# Altium project WULPUS_HV_PCB_V2.PrjPcb
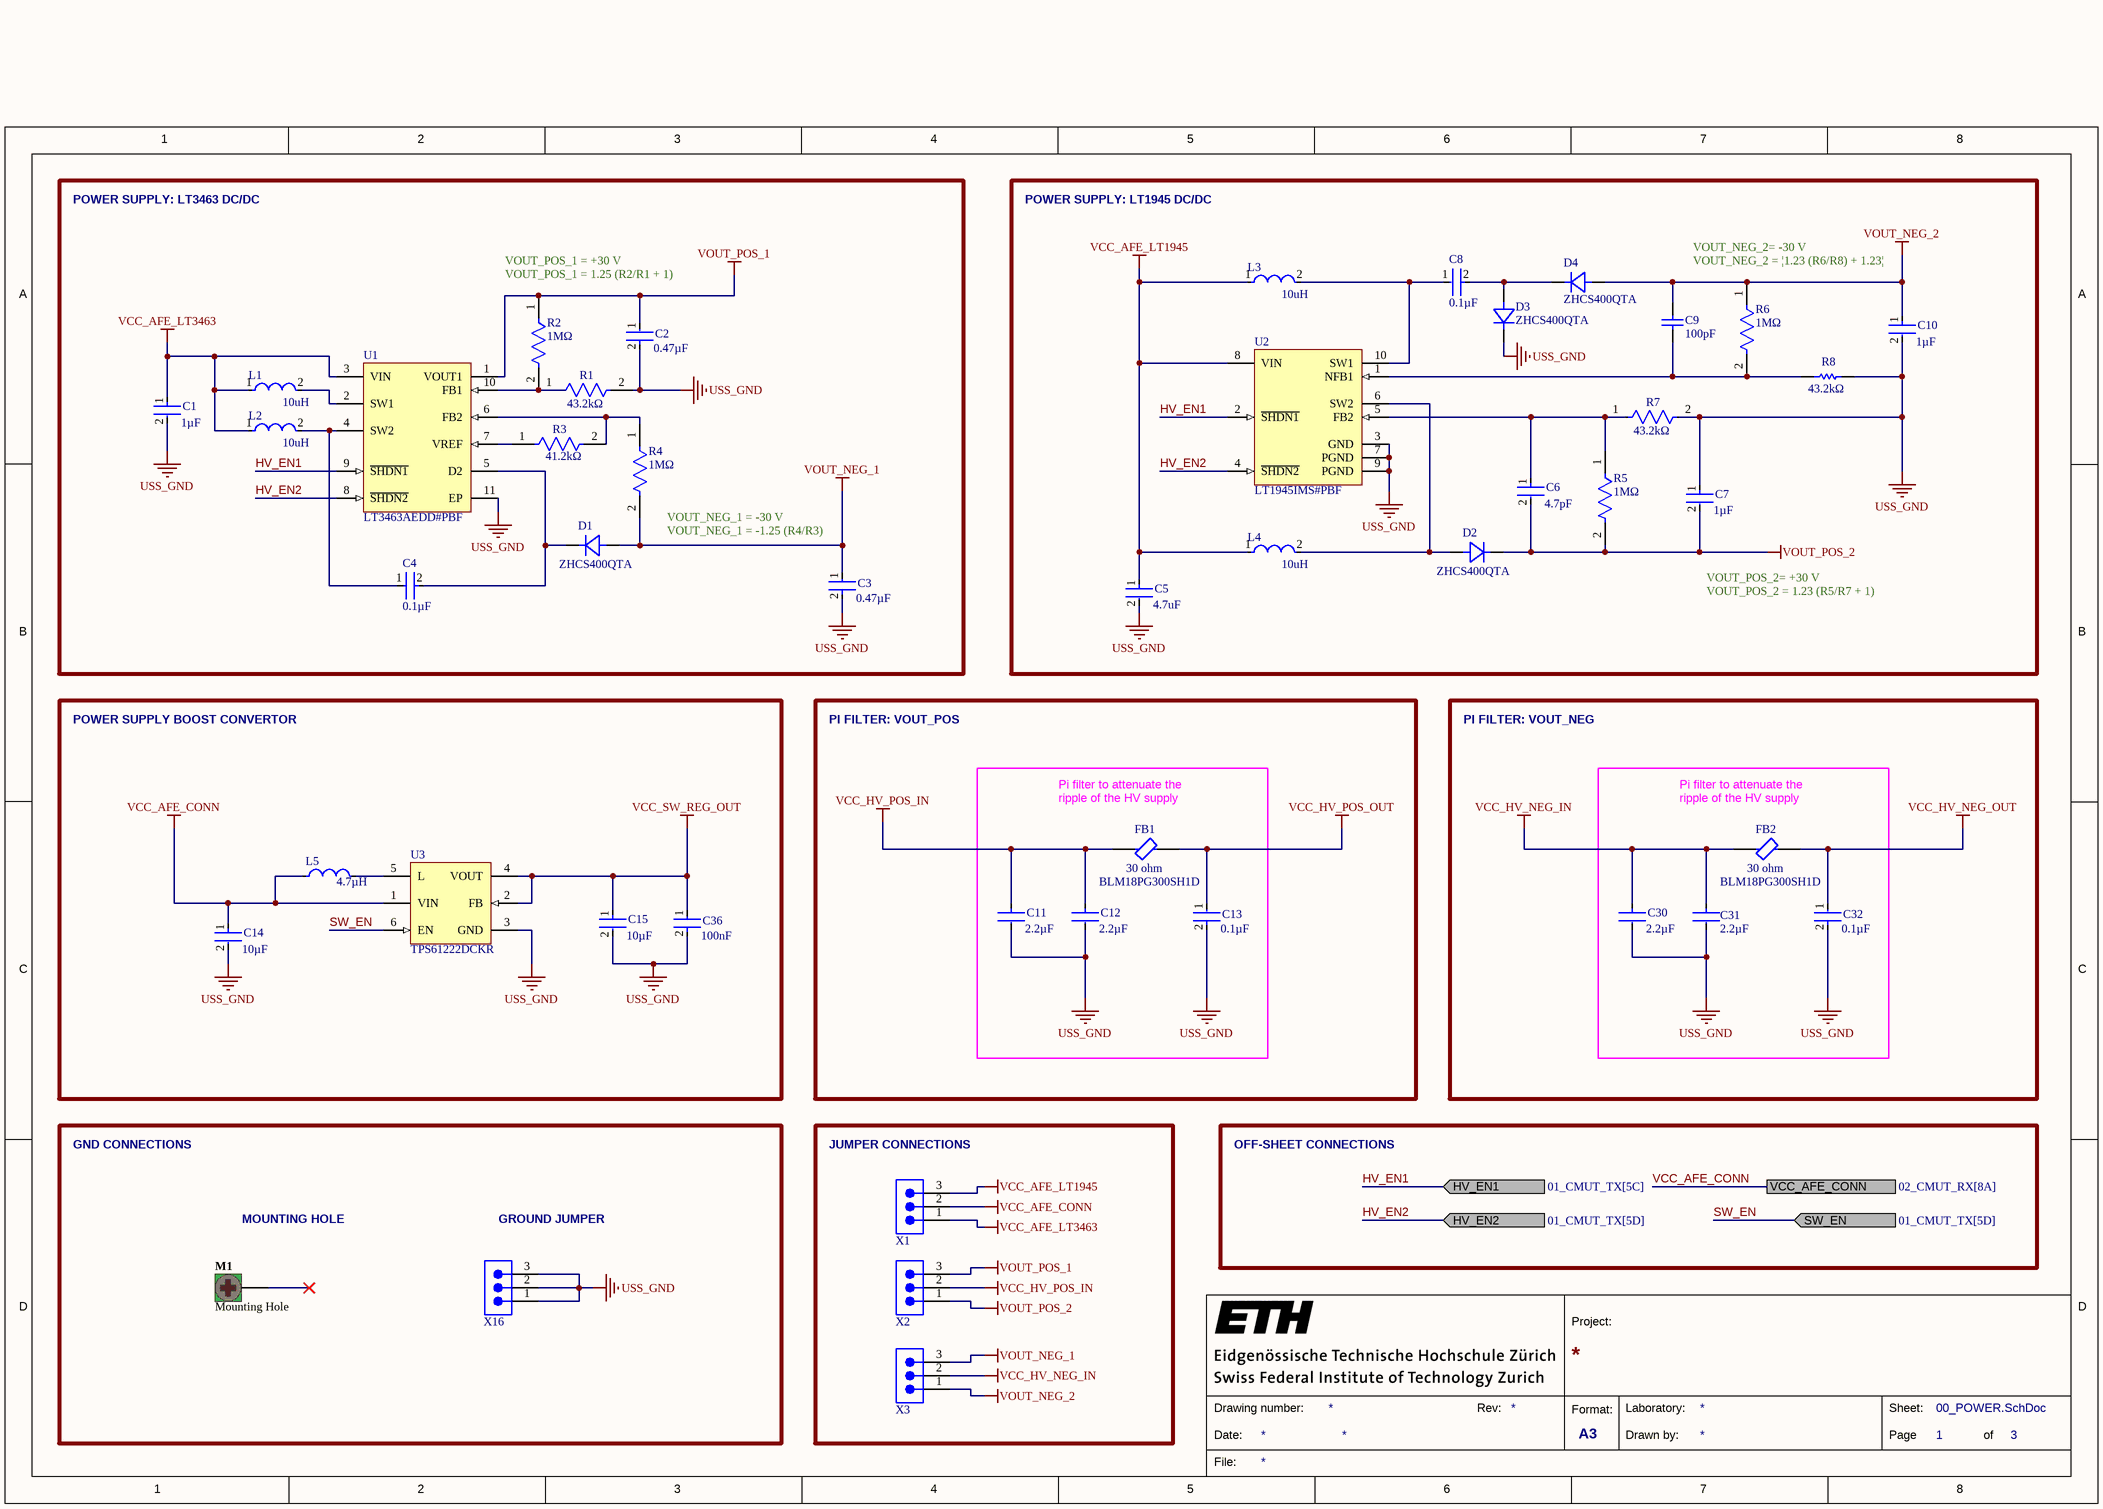
[diagram p0: 00_POWER.SchDoc]
3 sheets, 125 parts. Net scope: flat (ports and power ports of the same name join across sheets).
Board file: PCB1.PcbDoc
Sheets:
  00_POWER.SchDoc
  01_CMUT_TX.SchDoc
  02_CMUT_RX.SchDoc

## Sheet 00_POWER.SchDoc
size A3; SheetNumber: 1; SheetTotal: 3; SPICEModelCacheBHQUMUQP: <root> / <DocumentId>BHQUMUQP</DocumentId> / </root>

### Parts
C1  Capacitance: 1µF  [FP-CGA3E-0_3-0_1-IPC_B]  (hidden comment: CGA3E3X5R1H105K)
C2  Capacitance: 0.47µF  [FP-C1608-080-0_1-IPC_C]  (hidden comment: C1608X5R1H474K080AB)
C3  Capacitance: 0.47µF  [FP-C1608-080-0_1-IPC_C]  (hidden comment: C1608X5R1H474K080AB)
C4  Capacitance: 0.1µF  [FP-C1608-080-0_1-MFG]  (hidden comment: C1608X5R1H104K080AA)
C5  Capacitance: 4.7uF  [FP-C1608-080-0_2-MFG]  (hidden comment: C1608X5R1V475K080AC)
C6  Capacitance: 4.7pF  [FP-C0603C-CF-MFG]  (hidden comment: C0603C479K5GAC7867)
C7  Capacitance: 1µF  [FP-CGA3E-0_3-0_1-IPC_B]  (hidden comment: CGA3E3X5R1H105K)
C8  Capacitance: 0.1µF  [FP-C1608-080-0_1-MFG]  (hidden comment: C1608X5R1H104K080AA)
C9  Capacitance: 100pF  [CAPC1608X90X35LL15T15]  (hidden comment: 06035C101KAT2A)
C10  Capacitance: 1µF  [FP-CGA3E-0_3-0_1-IPC_B]  (hidden comment: CGA3E3X5R1H105K)
C11  Capacitance: 2.2µF  [FP-GRM188-0_2-IPC_C]  (hidden comment: GRM188R61H225KE11D)
C12  Capacitance: 2.2µF  [FP-GRM188-0_2-IPC_C]  (hidden comment: GRM188R61H225KE11D)
C13  Capacitance: 0.1µF  [FP-C1608-080-0_1-MFG]  (hidden comment: C1608X5R1H104K080AA)
C14  Capacitance: 10µF  [FP-GRM188-0_2-IPC_C]  (hidden comment: GRM188R6YA106MA73D)
C15  Capacitance: 10µF  [FP-GRM188-0_2-IPC_C]  (hidden comment: GRM188R6YA106MA73D)
C30  Capacitance: 2.2µF  [FP-GRM188-0_2-IPC_C]  (hidden comment: GRM188R61H225KE11D)
C31  Capacitance: 2.2µF  [FP-GRM188-0_2-IPC_C]  (hidden comment: Murata GRM188R61H225KE11D)
C32  Capacitance: 0.1µF  [FP-C1608-080-0_1-MFG]  (hidden comment: C1608X5R1H104K080AA)
C36  Capacitance: 100nF  [FP-C1608-080-0_1-MFG]  (hidden comment: C1608X5R1H104K080AA)
D1  ZHCS400QTA  [DIODE_SOD323_DIO]
D2  ZHCS400QTA  [DIODE_SOD323_DIO]
D3  ZHCS400QTA  [DIODE_SOD323_DIO]
D4  ZHCS400QTA  [DIODE_SOD323_DIO]
FB1  BLM18PG300SH1D  Impedance: 30 ohm  [FP-BLM18-0_15-t0_8-IPC_A]
FB2  BLM18PG300SH1D  Impedance: 30 ohm  [FP-BLM18-0_15-t0_8-IPC_A]
L1  Inductance: 10uH  [FP-B82422A-MFG]  (hidden comment: B82422A1103K100)
L2  Inductance: 10uH  [FP-B82422A-MFG]  (hidden comment: B82422A1103K100)
L3  Inductance: 10uH  [FP-B82422A-MFG]  (hidden comment: B82422A1103K100)
L4  Inductance: 10uH  [FP-B82422A-MFG]  (hidden comment: B82422A1103K100)
L5  Inductance: 4.7µH  [FP-NR3012-MFG]  (hidden comment: NR3012T4R7M)
M1  Mounting Hole  [Mounting Hole]  (no BOM)
R1  Resistance: 43.2kΩ  [FP-RC0603-0_55-MFG]  (hidden comment: RC0603FR-0743K2L)
R2  Resistance: 1MΩ  [FP-RC0603-0_55-IPC_C]  (hidden comment: RC0603JR-071ML)
R3  Resistance: 41.2kΩ  [FP-RK73H1J-IPC_A]  (hidden comment: RK73H1JTTDD4122D)
R4  Resistance: 1MΩ  [FP-RC0603-0_55-IPC_C]  (hidden comment: RC0603JR-071ML)
R5  Resistance: 1MΩ  [FP-RC0603-0_55-IPC_C]  (hidden comment: RC0603JR-071ML)
R6  Resistance: 1MΩ  [FP-RC0603-0_55-IPC_C]  (hidden comment: RC0603JR-071ML)
R7  Resistance: 43.2kΩ  [FP-RC0603-0_55-MFG]  (hidden comment: RC0603FR-0743K2L)
R8  Resistance: 43.2kΩ  [RESC1608X55X30ML20T10]  (hidden comment: RK73H1JTTD4322F)
U1  LT3463AEDD#PBF  [LT-DD-10_V]
U2  LT1945IMS#PBF  [LT-MS-10_L]
U3  TPS61222DCKR  [DCK0006A_L]
X1  68000-103HLF  [68000-103HLF]  (value not drawn)
X2  68000-103HLF  [68000-103HLF]  (value not drawn)
X3  68000-103HLF  [68000-103HLF]  (value not drawn)
X16  68000-103HLF  [68000-103HLF]  (value not drawn)

### Blocks framed on the sheet
POWER SUPPLY BOOST CONVERTOR: C14 C15 C36 L5 U3
PI FILTER: VOUT_POS: C11-C13 FB1
PI FILTER: VOUT_NEG: C30-C32 FB2
JUMPER CONNECTIONS: X1-X3

### Ports
HV_EN1 (in, see 01_CMUT_TX[5C]), HV_EN2 (in, see 01_CMUT_TX[5D]), SW_EN (in, see 01_CMUT_TX[5D]), VCC_AFE_CONN (see 02_CMUT_RX[8A])

### Nets
USS_GND: C1.2 C2.2 C3.2 C5.2 C7.1 C10.2 C11.2 C12.2 C13.2 C14.2 C15.2 C30.2 C31.2 C32.2 C36.2 D3.1 R1.2 R7.2 R8.2 U1.11(EP) U2.3(GND) U2.7(PGND) U2.9(PGND) U3.3(GND) X16.1 X16.2 X16.3
VCC_AFE_CONN: C14.1 L5.1 U3.1(VIN) X1.2 ; port VCC_AFE_CONN
VCC_AFE_LT1945: C5.1 L3.1 L4.1 U2.8(VIN) X1.3
VCC_AFE_LT3463: C1.1 L1.1 L2.1 U1.3(VIN) X1.1
VCC_HV_NEG_IN: C30.1 C31.1 FB2.1 X3.2
VCC_HV_NEG_OUT: C32.1 FB2.2
VCC_HV_POS_IN: C11.1 C12.1 FB1.1 X2.2
VCC_HV_POS_OUT: C13.1 FB1.2
VCC_SW_REG_OUT: C15.1 C36.1 U3.2(FB) U3.4(VOUT)
VOUT_NEG_1: C3.1 D1.2 R4.2 X3.3
VOUT_NEG_2: C9.2 C10.1 D4.2 R6.1 X3.1
VOUT_POS_1: C2.1 R2.1 U1.1(VOUT1) X2.3
VOUT_POS_2: C6.2 C7.2 D2.1 R5.2 X2.1
HV_EN1: U1.9(~{SHDN1}) U2.2(~{SHDN1}) ; port HV_EN1
HV_EN2: U1.8(~{SHDN2}) U2.4(~{SHDN2}) ; port HV_EN2
SW_EN: U3.6(EN) ; port SW_EN
NetC4_1: C4.1 L2.2 U1.4(SW2)
NetC4_2: C4.2 D1.1 U1.5(D2)
NetC6_1: C6.1 R5.1 R7.1 U2.5(FB2)
NetC8_1: C8.1 L3.2 U2.10(SW1)
NetC8_2: C8.2 D3.2 D4.1
NetC9_1: C9.1 R6.2 R8.1 U2.1(NFB1)
NetD2_2: D2.2 L4.2 U2.6(SW2)
NetL1_2: L1.2 U1.2(SW1)
NetL5_2: L5.2 U3.5(L)
NetR1_1: R1.1 R2.2 U1.10(FB1)
NetR3_1: R3.1 U1.7(VREF)
NetR3_2: R3.2 R4.1 U1.6(FB2)

Not connected (* = marked no-connect by the designer): M1 1*

### Notes on the sheet
- POWER SUPPLY: LT3463 DC/DC
- POWER SUPPLY: LT1945 DC/DC
- VOUT_POS_1 = 1.25 (R2/R1 + 1)
- VOUT_POS_1 = +30 V
- VOUT_NEG_2 = |1.23 (R6/R8) + 1.23|
- VOUT_NEG_2= -30 V
- VOUT_NEG_1 = -1.25 (R4/R3)
- (near R4) VOUT_NEG_1 = -30 V
- VOUT_POS_2= +30 V
- VOUT_POS_2 = 1.23 (R5/R7 + 1)
- (near FB1) Pi filter to attenuate the ripple of the HV supply
- (near FB2) Pi filter to attenuate the ripple of the HV supply
- GND CONNECTIONS
- OFF-SHEET CONNECTIONS
- MOUNTING HOLE
- (near X16) GROUND JUMPER
- 1
- 2
- 3
- 4
- 5
- 6
- 7
- 8
- A
- B
- C
- D
- Project:
- Date:
- Drawing number:
- Rev:
- Format:
- A3
- Drawn by:
- Laboratory:
- Page
- Sheet:
- of
- File:

### Library data of the parts
C1 C7 C10 = CMP-08246-000317-1: Cap Ceramic 1uF 50V X5R 10% Pad SMD 0603 +85°C Automotive T/R; Termination: SMD/SMT; Tolerance: 10%; Case Code (Metric): 1608; Max Operating Temperature: 85°C; Case/Package: 0603; Voltage Rating: 50V; Dielectric: X5R; Case Code (Imperial): 0603; Packaging: Tape and Reel; Min Operating Temperature: -55°C; Voltage Rating (DC): 50V
C2 C3 = CMP-08246-003456-1: Multilayer Ceramic Capacitors 470nF ±10% 50V X5R SMD 0603; Termination: SMD/SMT; Weight: 7.1E-05oz; Depth: 0.8mm; Mount: Surface Mount; Voltage Rating (DC): 50V; RoHS Compliant: Yes; Dielectric: X5R; Voltage: 50V; Package Quantity: 1; Series: C; Max Operating Temperature: 85°C; Construction: Flat; Tolerance: 10%; Voltage Rating: 50V; Packaging: Tape and Reel; Number of Pins: 2; Case Code (Imperial): 0603; Resistor Type: Ceramic; Min Operating Temperature: -55°C; Height: 0.8mm; Case/Package: 0603; Dielectric Material: Ceramic; Radiation Hardening: No; Case Code (Metric): 1608; REACH SVHC: No SVHC; Thickness: 0.035inch; Width: 0.031inch; Length: 1.6mm; Lead Free: Lead Free
C4 C8 C13 C32 C36 = CMP-08246-002719-1: Multilayer Ceramic Capacitors 100nF ±10% 50V X5R SMD 0603; Radiation Hardening: No; Length: 1.6mm; Package Quantity: 1; Thickness: 0.035inch; Max Operating Temperature: 85°C; Series: C; RoHS Compliant: Yes; Weight: 7.1E-05oz; Resistor Type: Ceramic; Case/Package: 0603; Voltage Rating: 50V; Tolerance: 10%; Width: 0.031inch; Voltage Rating (DC): 50V; Termination: SMD/SMT; Case Code (Metric): 1608; Construction: Flat; Mount: Surface Mount; Dielectric Material: Ceramic; Number of Pins: 2; Lead Free: Lead Free; Packaging: Tape and Reel; Min Operating Temperature: -55°C; Dielectric: X5R; Case Code (Imperial): 0603; Depth: 0.8mm; Height: 0.8mm; REACH SVHC: No SVHC
C5 = CMP-08246-004349-1: CAP CER 4.7UF 35V X5R 0603; Tolerance: 10%; Dielectric Material: Ceramic; Length: 0.063inch; Case/Package: 0603; Case Code (Metric): 1608; Packaging: Tape and Reel; Width: 0.031inch; Voltage Rating: 35V; Mount: Surface Mount; Package Quantity: 1; Depth: 0.8mm; Case Code (Imperial): 0603; Lead Free: Lead Free; Voltage Rating (DC): 35V; RoHS Compliant: Yes; Resistor Type: Ceramic; Series: C; Dielectric: X5R; Thickness: 0.039inch; Min Operating Temperature: -55°C; REACH SVHC: No SVHC; Max Operating Temperature: 85°C; Termination: SMD/SMT; Weight: 7.1E-05oz; Height: 0.8mm
C6 = CMP-03020-034431-1: CAP CER 4.7PF 50V NP0 0603; Manufacturer: KEMET; Automotive Grade: Grade 1; Material: Ceramic; Temperature Coefficient: 30ppm/°C; Temperature Characteristic: C0G; Tolerance: 0.1; Device Class L2: Capacitors; Temperature Range High: +125°C; Octopart: https://octopart.com/c0603c479k5gac7867-kemet-2009260; Temperature: -55°C to +125°C; Manufacturer Part Number: C0603C479K5GAC7867; Device Class L1: Passive Components; Temperature Range Low: -55°C; ComponentLink2Description: Datasheet; Automotive: Yes; Voltage Rating: 50 V; Height: 0.87mm; RoHS: TRUE; Digikey Description: CAP CER 4.7PF 50V NP0 0603; ComponentLink2URL: https://api.kemet.com/component-edge/download/datasheet/C0603C100J5GACAUTO.pdf; Lead Free: Yes; Package: C0603C-CF; Device Class L3: Ceramic Capacitors; Category: Cap; Value: 4.7 pF
C9 = CMP-2006-04375-1: Manufacturer: AVX Interconnect / Elco; Part Number: 06035C101KAT2A
C11 C12 C30 C31 = CMP-06035-042125-1: Chip Multilayer Ceramic Capacitors for General Purpose, 0603, 2.2uF, X5R, 15%, 10%, 50V; Case Code (Metric): 1608; Packaging: Cut Tape; REACH SVHC: No SVHC; Material: Ceramic; Voltage Rating: 50V; Min Operating Temperature: -55°C; Length: 0.063inch; Case Code (Imperial): 0603; Tolerance: 10%; Thickness: 0.039inch; Height: 0.8mm; Case/Package: 0603; Voltage Rating (DC): 50V; Dielectric: X5R; Mount: Surface Mount; Max Operating Temperature: 85°C; Width: 0.031inch
C14 C15 = CMP-06035-045466-1: Chip Multilayer Ceramic Capacitors for General Purpose, 0603, 10uF, X5R, 15%, 20%, 35V; Case Code (Imperial): 0603; Voltage Rating (DC): 35V; Width: 0.031inch; Dielectric: X5R; Voltage Rating: 35V; Min Operating Temperature: -55°C; Thickness: 0.039inch; Mount: Surface Mount; Case/Package: 0603; Length: 0.063inch; Max Operating Temperature: 85°C; Packaging: Tape and Reel; Tolerance: 20%; Case Code (Metric): 1608
D1-D4 = ZHCS400QTA: Diode Schottky 40V 1A Automotive 2-Pin SOD-323 T/R; Manufacturer: Diodes; Supplier 1: Farnell; RoHS: Yes; Category: Rectifier Diodes; Stock 1: 385; Pricing 1: 5=0.87300, 10=0.73400, 100=0.49400, 500=0.38800 (CHF); Mount: Surface Mount; Packaging: Tape and Reel; Average Rectified Current: 1A; Max Reverse Voltage (DC): 40V; RoHS Compliant: Yes; ComponentLink1URL: http://www.mouser.com/ds/2/115/ZHCS400Q-959646.pdf?src-supplier=Mouser; ComponentLink1Description: http://www.mouser.com/ds/2/115/ZHCS400Q-959646.pdf?src-supplier=Mouser; Supplier Part Number 1: 3127490; Manufacturer Part Number: ZHCS400QTA
FB1 FB2 = CMP-06046-000808-1: Chip Ferrite Bead, 0603, 30Ω @ 100MHz, 0.05Ω, , 1A; Tolerance: 25%; Shielding: Unshielded; DC Resistance (DCR): 50mR; Number of Lines: 1; Width: 0.031inch; Termination: SMD/SMT; Case Code (Metric): 1608; Max DC Current: 1A; Case Code (Imperial): 0603; Height: 0.037inch; Max Operating Temperature: 125°C; Max Current Rating: 1A; Case/Package: 0603; Length: 1.6mm; Number of Circuits: 1; Test Frequency: 100MHz; Contact Plating: Tin; Ratings: AEC-Q200; Package Quantity: 1; Mount: Surface Mount; Packaging: Tape and Reel; Min Operating Temperature: -55°C
L1-L4 = CMP-2000-05912-2: FIXED IND 10UH 180MA 1.6 OHM SMD; Tolerance: 10%; DC Resistance (DCR): 1.6R; Shielding: Unshielded; Core Material: Ferrite; Q Factor: 27; Self Resonant Frequency: 25MHz; Test Frequency: 1MHz; Series: SIMID; Current Rating: 180mA; Ratings: AEC-Q200; Height - Seated (Max): 0.083inch; Packaging: Tape and Reel; Radiation Hardening: No; REACH SVHC: No SVHC; Width: 0.098inch; RoHS Compliant: Yes; Case/Package: 1210; DC Current: 180mA; Package Quantity: 2000; Rated Current-Max: 180mA; Mount: Surface Mount; Depth: 2.8mm; Resistor Type: Wirewound; Max DC Current: 180mA; Termination: SMD/SMT; Contact Plating: Tin; Height: 2.1mm; Case Code (Metric): 3225; Lead Free: Lead Free; Weight: 0.001764oz; Max Operating Temperature: 125°C; Length: 3.5mm; Case Code (Imperial): 1210; Inductance Tolerance: 10%; Series Resistance: 1.6R; Number of Pins: 2; Military Standard: Not
L5 = CMP-14484-001484-1: SMD Power Inductors 4.7uH ±20% 0.77A 0.13Ω; Saturation Current: 770mA; Self Resonant Frequency: 48MHz; RMS Current (Irms): 980mA; Test Frequency: 100kHz; Core Material: Ferrite; Shielding: Shielded; DC Resistance (DCR): 156mR; Series: NR; Case Code (Metric): 3030; Halogen Free: Halogen Free; Tolerance: 20%; Resistor Type: Wirewound; Mount: Surface Mount; Case/Package: 1212; Max DC Current: 770mA; Length: 0.118inch; Height - Seated (Max): 0.047inch; Termination: SMD/SMT; Package Quantity: 2000; DC Current: 980mA; Depth: 3.1mm; Packaging: Tape and Reel; Height: 1.2mm; Current Rating: 980mA; Min Operating Temperature: -25°C; Case Code (Imperial): 1212; Lead Free: Lead Free; Military Standard: Not; Width: 0.118inch; Max Operating Temperature: 120°C; Radiation Hardening: No; Inductance Tolerance: 20%; RoHS Compliant: Yes
M1 = CMP-00274-1: M2 Hole, 2.4mm drill, 5mm landing pads, 3mm pad in middle layers, no overlay; ClassName: Mounting Hole
R1 R7 = CMP-03412-037801-1: RES SMD 43.2K OHM 1% 1/10W 0603; Power Rating: 100mW; Voltage Rating (DC): 50V; Temperature Coefficient: 100ppm/°C; Depth: 0.8mm; Resistor Type: Thick Film; Mount: Surface Mount; Height: 0.45mm; Termination: SMD/SMT; Case Code (Imperial): 0603; Case Code (Metric): 1608; Case/Package: 0603; Length: 1.6mm; Min Operating Temperature: -55°C; Max Power Dissipation: 100mW; Construction: Rectangular; Lead Free: Lead Free; Features: Moisture Resistant; Technology: THICK FILM; RoHS Compliant: Yes; Packaging: Tape and Reel; Package Quantity: 1; Width: 0.031inch; Tolerance: 1%; Number of Terminations: 2; Series: RC; Voltage Rating: 50V; Max Operating Temperature: 155°C; Size Code: 0603; Military Standard: Not
R2 R4-R6 = CMP-2000-06953-2: RES SMD 1M OHM 5% 1/10W 0603; Voltage Rating (DC): 50V; Power Rating: 100mW; Temperature Coefficient: 100ppm/°C; Features: Moisture Resistant; Package Quantity: 5000; Case Code (Imperial): 0603; Packaging: Tape and Reel; Resistor Type: Thick Film; Number of Pins: 2; Size Code: 0603; Resistance Tolerance: 5%; Max Operating Temperature: 155°C; Voltage Rating: 50V; Depth: 0.8mm; Termination: SMD/SMT; Width: 0.8mm; RoHS Compliant: Yes; Number of Terminations: 2; Height: 0.45mm; Lead Free: Lead Free; Case/Package: 0603; Military Standard: Not; Min Operating Temperature: -55°C; Case Code (Metric): 1608; Radiation Hardening: No; Series: RC; Length: 1.6mm; Tolerance: 5%; REACH SVHC: No SVHC; Contact Plating: Tin; Construction: Rectangular; Max Power Dissipation: 100mW
R3 = CMP-04015-070888-1: 41.2kΩ ±0.5% 0.1W Chip Resistor 0603 Thick Film AEC-Q200 Qualified; Power Rating: 100mW; Voltage Rating: 50V; Temperature Coefficient: 100ppm/°C; Packaging: Tape and Reel; RoHS Compliant: Yes; Case Code (Imperial): 0603; Termination: SMD/SMT; Case Code (Metric): 1608; Max Operating Temperature: 155°C; Length: 1.6mm; Height: 0.45mm; Min Operating Temperature: -55°C; Case/Package: 0603; Width: 0.8mm; Resistor Type: Thick Film; Series: RK73H; Tolerance: 0.5%; Weight: 7.1E-05oz
R8 = CMP-2000-01507-1: Manufacturer: KOA Speer; Part Number: RK73H1JTTD4322F
U1 = CMP-0478-00030-1: Dual Micropower DC/DC Converters with Schottky Diodes, 2.4 to 15 V Vin, 10-pin SON (DD-10), -40 to 85 degC, Pb-Free; Manufacturer: Linear Technology; Vin Max(V): 15; Number of Outputs: 2; Vin Min(V): 2.4; ComponentLink3URL: http://cds.linear.com/docs/en/packaging/DFN_10_05-08-1699.pdf; ComponentLink2URL: http://cds.linear.com/docs/en/datasheet/3463f.pdf; PackageReference: DD-10; PackageVersion: Rev. C, 06/2010; ComponentLink1URL: http://www.linear.com/; RoHS: TRUE; ComponentLink3Description: Package Specification; Mounting Technology: Surface Mount; PartNumber: LT3463AEDD#PBF; Code_JEDEC: MO-229; ComponentLink2Description: Datasheet; PackageDescription: 10-Pin Plastic DFN, Body 3 x 3 mm, Pitch 0.5 mm; ComponentLink1Description: Manufacturer URL
U2 = CMP-0478-00154-1: Dual Micropower DC/DC Converter with Positive and Negative Outputs, 1.2 to 15 V Vin, 10-pin SOP (MS-10), -40 to 125 degC, Pb-Free; Manufacturer: Linear Technology; Vin Min(V): 1.2; Vin Max(V): 15; Number of Outputs: 2; Mounting Technology: Surface Mount; ComponentLink3Description: Package Specification; ComponentLink3URL: http://cds.linear.com/docs/en/packaging/05081661_F_MS.pdf; PackageVersion: Rev. E, 06/2010; ComponentLink2URL: http://cds.linear.com/docs/en/datasheet/1945fa.pdf; PartNumber: LT1945IMS#PBF; DatasheetVersion: Rev. A; PackageReference: MS-10; PackageDescription: 10-Pin Plastic MSOP, Body 3 x 3 mm, Pitch 0.5 mm; ComponentLink2Description: Datasheet; RoHS: TRUE; ComponentLink1URL: http://www.linear.com/; ComponentLink1Description: Manufacturer URL
U3 = CMP-0347-00055-2: Boost Voltage Converter with 0.7 to 5.5 V Input and 5 V Output, -40 to 85 degC, 6-Pin SC70 (DCK), Green (RoHS & no Sb/Br); Manufacturer: Texas Instruments; Vout(Min)(V): 5; SubFamily: Step-Up Regulator; Vin(Min)(V): 0.7; Switching Frequency(Max)(kHz): 2000; Regulated Outputs(#): 1; Vin(Max)(V): 5.5; Topology: Boost; Vout(Max)(V): 5; PackageVersion: revG, Jan-2007; Mounting Technology: Surface Mount; ComponentLink2URL: http://www.ti.com/litv/pdf/mpds114c; PackageReference: DCK0006A; DatasheetVersion: SLVS776; PartNumber: TPS61222DCKR; ComponentLink1Description: Datasheet; ComponentLink1URL: http://www.ti.com/general/docs/lit/getliterature.tsp?genericPartNumber=TPS61222&fileType=pdf; ComponentLink2Description: Package Specification; Eco-Plan: Green (RoHS & no Sb/Br); Code_JEDEC: MO-203-AB; PackageDescription: 6-Pin Plastic Small-Outline Package, 2 x 1.3 mm Body, 0.65 mm Pitch, 2.1 mm Lead Span
X1-X3 X16 = CMP-00101-2: 3 Positions Header, Unshrouded Connector 0.100" (2.54mm) Through Hole Gold or Gold, GXT™; Manufacturer: Amphenol FCI; Current Rating: 3A; Insulation Resistance: 5GR; Number of Positions: 3; Max Voltage Rating (AC): 1.5kV; Termination: Solder; Fastening Type: -; Features: -; Contact Finish: Gold or Gold, GXT™; Contact Finish Thickness: 15µin (0.38µm); Color: Black; Supplier: Digikey; Supplier Part Number: 609-3461-ND; ComponentLink1Description: 68000-274283-5157301.pdf; ComponentLink1URL: https://datasheet.ciiva.com/5157/68000-274283-5157301.pdf; Depth: 2.41mm; Flammability Rating: UL94 V-0; Housing Colour: Black; Housing Material: Thermoplastic; Length: 7.62mm; Manufacturer Part Number: 68000-103HLF; Max Operating Temperature: 125°C; Packaging: Bulk; Contact Type: Male Pin; Connector Type: Header, Unshrouded; Pitch: 2.54mm; Number of Rows: 1; Contact Mating Length: 0.230" (5.84mm); Mounting Type: Through Hole; Min Operating Temperature: -65°C; Number of Contacts: 3; Orientation: Straight; Package Quantity: 100; Radiation Hardening: No; REACH SVHC: No SVHC; Termination Post Length: 2.41mm; Voltage Rating: 1.5kV; Contact Gender: Male; Contact Material: Bronze; Contact Plating: Nickel,Gold,GXT; ComponentLink2Description: 68000-731071.pdf; ComponentLink2URL: https://datasheet.ciiva.com/731/68000-731071.pdf; ComponentLink3Description: 68000-10149754.pdf; ComponentLink3URL: https://datasheet.ciiva.com/10149/68000-10149754.pdf; ComponentLink4Description: 1914865-46392021.pdf; ComponentLink4URL: https://datasheet.ciiva.com/46392/1914865-46392021.pdf

## Sheet 01_CMUT_TX.SchDoc
size A3; SheetNumber: 2; SheetTotal: 3
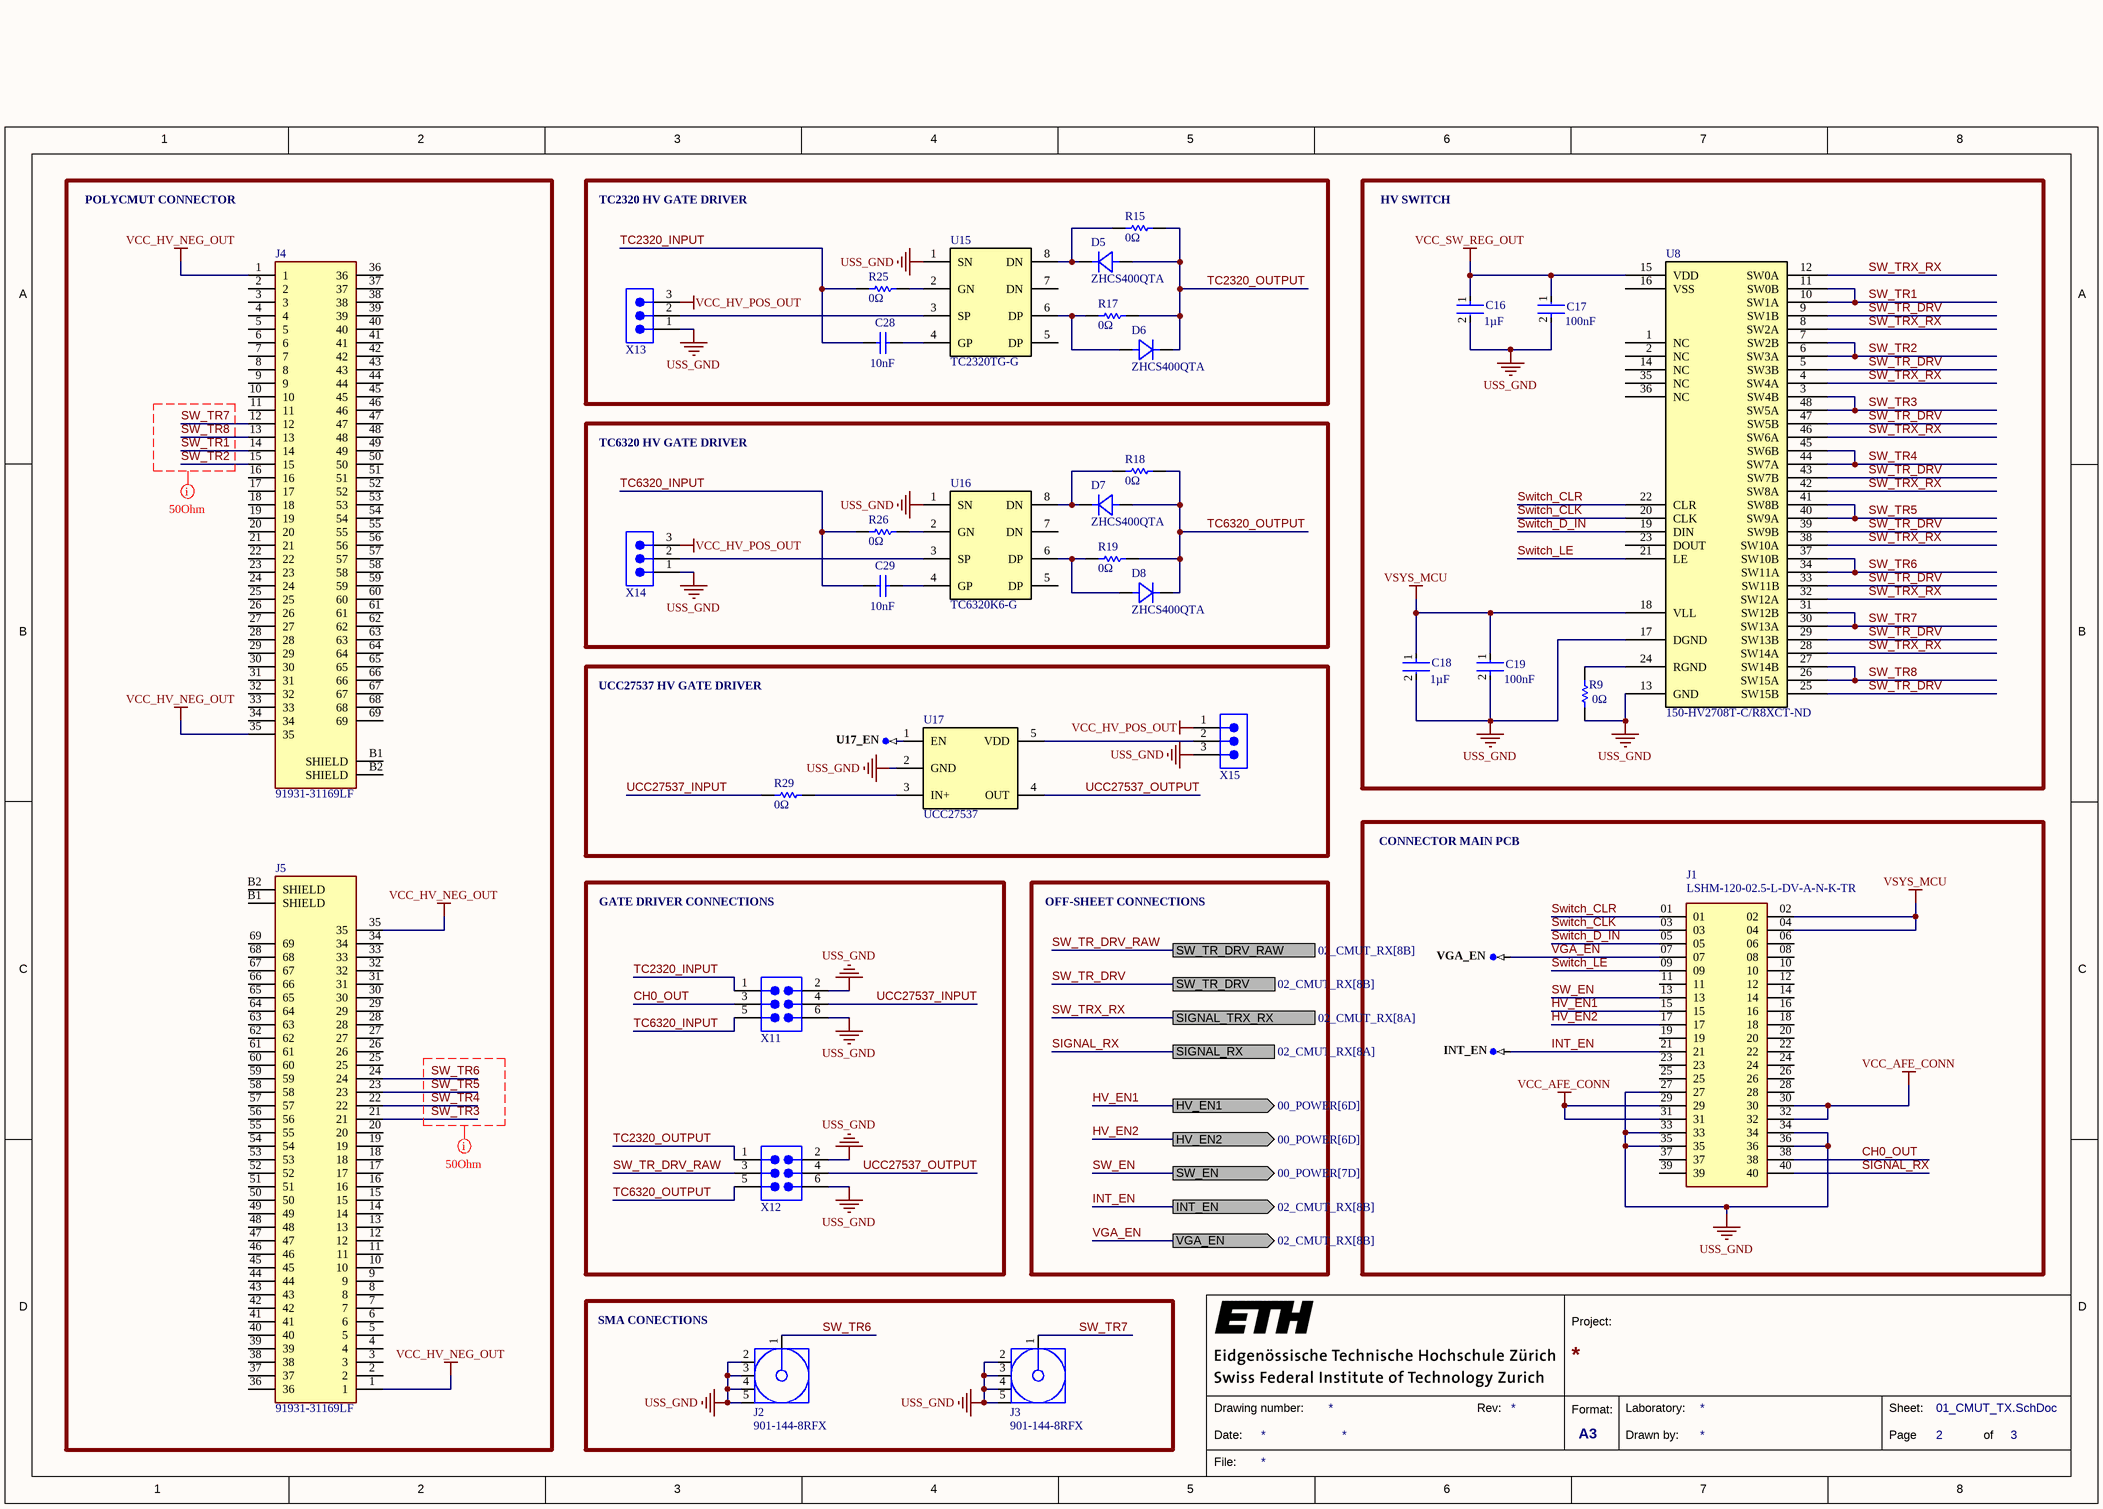
[diagram p1: 01_CMUT_TX.SchDoc]

### Parts
C16  Capacitance: 1µF  [FP-CGA3E-0_3-0_1-IPC_B]  (hidden comment: CGA3E3X5R1H105K)
C17  Capacitance: 100nF  [FP-C1608-080-0_1-MFG]  (hidden comment: C1608X5R1H104K080AA)
C18  Capacitance: 1µF  [FP-CGA3E-0_3-0_1-IPC_B]  (hidden comment: CGA3E3X5R1H105K)
C19  Capacitance: 100nF  [FP-C1608-080-0_1-MFG]  (hidden comment: C1608X5R1H104K080AA)
C28  Capacitance: 10nF  [CAPC1608X90X35NL15T15]  (hidden comment: 06035D103KAT2A)
C29  Capacitance: 10nF  [CAPC1608X90X35NL15T15]  (hidden comment: 06035D103KAT2A)
D5  ZHCS400QTA  [DIODE_SOD323_DIO]
D6  ZHCS400QTA  [DIODE_SOD323_DIO]
D7  ZHCS400QTA  [DIODE_SOD323_DIO]
D8  ZHCS400QTA  [DIODE_SOD323_DIO]
INT_EN  TP-SM-C-100  [TP-SM-C-100]  (value not drawn)  (no BOM)
J1  LSHM-120-02.5-L-DV-A-N-K-TR  [SAMTEC_LSHM-120-XX.X-X-DV-A-N-XX]
J2  901-144-8RFX  [AMPH-901-144-8RFX_V]
J3  901-144-8RFX  [AMPH-901-144-8RFX_V]
J4  91931-31169LF  [FRAMETOME_91931-31169LF]
J5  91931-31169LF  [FRAMETOME_91931-31169LF]
R9  Resistance: 0Ω  [RESC1608X55X25NL10T15]  (hidden comment: RC0603JR-130RL)
R15  Resistance: 0Ω  [RESC1608X55X25NL10T15]  (hidden comment: RC0603JR-130RL)
R17  Resistance: 0Ω  [RESC1608X55X25NL10T15]  (hidden comment: RC0603JR-130RL)
R18  Resistance: 0Ω  [RESC1608X55X25NL10T15]  (hidden comment: RC0603JR-130RL)
R19  Resistance: 0Ω  [RESC1608X55X25NL10T15]  (hidden comment: RC0603JR-130RL)
R25  Resistance: 0Ω  [RESC1608X55X25NL10T15]  (hidden comment: RC0603JR-130RL)
R26  Resistance: 0Ω  [RESC1608X55X25NL10T15]  (hidden comment: RC0603JR-130RL)
R29  Resistance: 0Ω  [RESC1608X55X25NL10T15]  (hidden comment: RC0603JR-130RL)
U8  Supplier Part Number 1: 150-HV2708T-C/R8XCT-ND  [LQFP48_7X7MC_MCH]  (hidden comment: HV2708T-C/R8X)
U15  TC2320TG-G  [SOIC127P599X173-8N]
U16  TC6320K6-G  [SOIC127P599X173-8N]
U17  UCC27537  [SOT95P280X145-5N]
U17_EN  TP-SM-C-100  [TP-SM-C-100]  (value not drawn)  (no BOM)
VGA_EN  TP-SM-C-100  [TP-SM-C-100]  (value not drawn)  (no BOM)
X11  67996-106HLF  [67996-106HLF]  (value not drawn)
X12  67996-106HLF  [67996-106HLF]  (value not drawn)
X13  68000-103HLF  [68000-103HLF]  (value not drawn)
X14  68000-103HLF  [68000-103HLF]  (value not drawn)
X15  68000-103HLF  [68000-103HLF]  (value not drawn)

### Blocks framed on the sheet
POLYCMUT CONNECTOR: J4 J5
TC2320 HV GATE DRIVER: C28 D5 D6 R15 R17 R25 U15 X13
HV SWITCH: C16-C19 R9 U8
TC6320 HV GATE DRIVER: C29 D7 D8 R18 R19 R26 U16 X14
UCC27537 HV GATE DRIVER: R29 U17 U17_EN X15
CONNECTOR MAIN PCB: INT_EN J1 VGA_EN
GATE DRIVER CONNECTIONS: X11 X12
SMA CONECTIONS: J2 J3

### Ports
HV_EN1 (out, see 00_POWER[6D]), HV_EN2 (out, see 00_POWER[6D]), INT_EN (out, see 02_CMUT_RX[8B]), SIGNAL_RX (see 02_CMUT_RX[8A]), SIGNAL_TRX_RX (see 02_CMUT_RX[8A]), SW_EN (out, see 00_POWER[7D]), SW_TR_DRV (see 02_CMUT_RX[8B]), SW_TR_DRV_RAW (see 02_CMUT_RX[8B]), VGA_EN (out, see 02_CMUT_RX[8B])

### Nets
SW_TR_DRV: U8.5(SW3B) U8.9(SW1B) U8.25(SW15B) U8.29(SW13B) U8.33(SW11B) U8.39(SW9B) U8.43(SW7B) U8.47(SW5B) ; port SW_TR_DRV
SW_TR_DRV_RAW: X12.3 ; port SW_TR_DRV_RAW
USS_GND: C16.2 C17.2 C18.2 C19.2 J1.27 J1.33 J1.34 J1.35 J1.36 J2.2 J2.3 J2.4 J2.5 J3.2 J3.3 J3.4 J3.5 R9.1 U8.13(GND) U8.17(DGND) U15.1(SN) U16.1(SN) U17.2(GND) X11.2 X11.6 X12.2 X12.6 X13.1 X14.1 X15.3
VCC_AFE_CONN: J1.29 J1.30 J1.31 J1.32
VCC_HV_NEG_OUT: J4.1 J4.35 J5.1 J5.35
VCC_HV_POS_OUT: X13.3 X14.3 X15.1
VCC_SW_REG_OUT: C16.1 C17.1 U8.15(VDD)
VSYS_MCU: C18.1 C19.1 J1.02 J1.04 U8.18(VLL)
CH0_OUT: J1.38 X11.3
HV_EN1: J1.15 ; port HV_EN1
HV_EN2: J1.17 ; port HV_EN2
INT_EN: INT_EN.1 J1.21 ; port INT_EN
SIGNAL_RX: J1.40 ; port SIGNAL_RX
SW_EN: J1.13 ; port SW_EN
SW_TR1: J4.14 U8.10(SW1A) U8.11(SW0B)
SW_TR2: J4.15 U8.6(SW3A) U8.7(SW2B)
SW_TR3: J5.21 U8.3(SW4B) U8.48(SW5A)
SW_TR4: J5.22 U8.44(SW7A) U8.45(SW6B)
SW_TR5: J5.23 U8.40(SW9A) U8.41(SW8B)
SW_TR6: J2.1 J5.24 U8.34(SW11A) U8.37(SW10B)
SW_TR7: J3.1 J4.12 U8.30(SW13A) U8.31(SW12B)
SW_TR8: J4.13 U8.26(SW15A) U8.27(SW14B)
SW_TRX_RX: U8.4(SW4A) U8.8(SW2A) U8.12(SW0A) U8.28(SW14A) U8.32(SW12A) U8.38(SW10A) U8.42(SW8A) U8.46(SW6A) ; port SIGNAL_TRX_RX  [project net SIGNAL_TRX_RX]
Switch_CLK: J1.03 U8.20(CLK)
Switch_CLR: J1.01 U8.22(CLR)
Switch_D_IN: J1.05 U8.19(DIN)
Switch_LE: J1.09 U8.21(LE)
TC2320_INPUT: C28.1 R25.2 X11.1
TC2320_OUTPUT: D5.2 D6.1 R15.1 R17.1 X12.1
TC6320_INPUT: C29.1 R26.2 X11.5
TC6320_OUTPUT: D7.2 D8.1 R18.1 R19.1 X12.5
UCC27537_INPUT: R29.2 X11.4
UCC27537_OUTPUT: U17.4(OUT) X12.4
VGA_EN: J1.07 VGA_EN.1 ; port VGA_EN
NetC28_2: C28.2 U15.4(GP)
NetC29_2: C29.2 U16.4(GP)
NetD5_1: D5.1 R15.2 U15.8(DN)
NetD6_2: D6.2 R17.2 U15.6(DP)
NetD7_1: D7.1 R18.2 U16.8(DN)
NetD8_2: D8.2 R19.2 U16.6(DP)
NetR9_2: R9.2 U8.24(RGND)
NetR25_1: R25.1 U15.2(GN)
NetR26_1: R26.1 U16.2(GN)
NetR29_1: R29.1 U17.3(IN+)
NetU15_3: U15.3(SP) X13.2
NetU16_3: U16.3(SP) X14.2
NetU17_1: U17.1(EN) U17_EN.1
NetU17_5: U17.5(VDD) X15.2

Not connected (* = marked no-connect by the designer): J1 06 08 10 11 12 14 16 18 19 20 22 23 24 25 26 28 37 39; J4 2 3 4 5 6 7 8 9 10 11 16 17 18 19 20 21 22 23 24 25 26 27 28 29 30 31 32 33 34 36 37 38 39 40 41 42 43 44 45 46 47 48 49 50 51 52 53 54 55 56 57 58 59 60 61 62 63 64 65 66 67 68 69 B1(SHIELD) B2(SHIELD); J5 2 3 4 5 6 7 8 9 10 11 12 13 14 15 16 17 18 19 20 25 26 27 28 29 30 31 32 33 34 36 37 38 39 40 41 42 43 44 45 46 47 48 49 50 51 52 53 54 55 56 57 58 59 60 61 62 63 64 65 66 67 68 69 B1(SHIELD) B2(SHIELD); U8 1(NC) 2(NC) 14(NC) 16(VSS) 23(DOUT) 35(NC) 36(NC); U15 5(DP) 7(DN); U16 5(DP) 7(DN)

### Layout directives
net class *: SW_TR1, SW_TR2, SW_TR3, SW_TR4, SW_TR5, SW_TR6, SW_TR7, SW_TR8

### Notes on the sheet
- OFF-SHEET CONNECTIONS
- 1
- 2
- 3
- 4
- 5
- 6
- 7
- 8
- A
- B
- C
- D
- Project:
- Date:
- Drawing number:
- Rev:
- Format:
- A3
- Drawn by:
- Laboratory:
- Page
- Sheet:
- of
- File:

### Library data of the parts
C16 C18 = CMP-08246-000317-1: as C1 on sheet 00_POWER; Termination: SMD/SMT; Tolerance: 10%; Case Code (Metric): 1608; Max Operating Temperature: 85°C; Case/Package: 0603; Voltage Rating: 50V; Dielectric: X5R; Case Code (Imperial): 0603; Packaging: Tape and Reel; Min Operating Temperature: -55°C; Voltage Rating (DC): 50V
C17 C19 = CMP-08246-002719-1: as C4 on sheet 00_POWER; Radiation Hardening: No; Length: 1.6mm; Package Quantity: 1; Thickness: 0.035inch; Max Operating Temperature: 85°C; Series: C; RoHS Compliant: Yes; Weight: 7.1E-05oz; Resistor Type: Ceramic; Case/Package: 0603; Voltage Rating: 50V; Tolerance: 10%; Width: 0.031inch; Voltage Rating (DC): 50V; Termination: SMD/SMT; Case Code (Metric): 1608; Construction: Flat; Mount: Surface Mount; Dielectric Material: Ceramic; Number of Pins: 2; Lead Free: Lead Free; Packaging: Tape and Reel; Min Operating Temperature: -55°C; Dielectric: X5R; Case Code (Imperial): 0603; Depth: 0.8mm; Height: 0.8mm; REACH SVHC: No SVHC
C28 C29 = CMP-2006-04462-1: Manufacturer: AVX Interconnect / Elco; Part Number: 06035D103KAT2A
D5-D8 = ZHCS400QTA: as D1 on sheet 00_POWER; Supplier 1: Farnell; RoHS: Yes; Category: Rectifier Diodes; Stock 1: 385; Pricing 1: 5=0.87300, 10=0.73400, 100=0.49400, 500=0.38800 (CHF); Mount: Surface Mount; Packaging: Tape and Reel; Average Rectified Current: 1A; Max Reverse Voltage (DC): 40V; RoHS Compliant: Yes; ComponentLink1URL: http://www.mouser.com/ds/2/115/ZHCS400Q-959646.pdf?src-supplier=Mouser; ComponentLink1Description: http://www.mouser.com/ds/2/115/ZHCS400Q-959646.pdf?src-supplier=Mouser; Supplier Part Number 1: 3127490; Manufacturer Part Number: ZHCS400QTA
INT_EN U17_EN VGA_EN = CMP-0484-00002-2: Test Point, Surface Mount, Circular, Pad Diameter 1 mm; Manufacturer: No Vendor; PartNumber: TP-SM-C-100
J1 = LSHM-120-02.5-L-DV-A-N-K-TR: Conn Socket and Terminal Strip HDR/SKT 40 POS 0.5mm Solder ST SMD T/R; Manufacturer: Samtec; Number of Contacts: 40; Supplier 1: Digi-Key; RoHS: Yes; Category: Connectors; Stock 1: 3008; Pricing 1: 1=6.60000, 10=5.97000, 25=5.63960, 50=5.50200, 100=5.22690, 250=4.67672 (USD); Contact Plating: Gold; Contact Material: Bronze; Housing Color: Black; Housing Material: Polymer; Min Operating Temperature: -55°C; Max Operating Temperature: 125°C; Number of Rows: 2; Termination: Solder; Packaging: Tape and Reel; Orientation: Straight; Series: LSH; Length: 14.7mm; Pitch: 0.5mm; Depth: 4.98mm; Radiation Hardening: No; REACH SVHC: No SVHC; RoHS Compliant: Yes; ComponentLink1URL: http://www.farnell.com/datasheets/2372721.pdf?src-supplier=Farnell; ComponentLink1Description: http://www.farnell.com/datasheets/2372721.pdf?src-supplier=Farnell; ComponentLink2URL: http://www.farnell.com/datasheets/2000266.pdf?src-supplier=Farnell; ComponentLink2Description: http://www.farnell.com/datasheets/2000266.pdf?src-supplier=Farnell; ComponentLink3URL: http://components.arrow.com/part/dataview/0323_01943898?src-supplier=Arrow+Europe; ComponentLink3Description: http://components.arrow.com/part/dataview/0323_01943898?src-supplier=Arrow+Europe; ComponentLink4URL: http://components.arrow.com/part/dataview/48680868S8397842N1004?src-supplier=Arrow+Electronics; ComponentLink4Description: http://components.arrow.com/part/dataview/48680868S8397842N1004?src-supplier=Arrow+Electronics; ComponentLink5URL: http://www.farnell.com/datasheets/2000266.pdf?src-supplier=Element14; ComponentLink5Description: http://www.farnell.com/datasheets/2000266.pdf?src-supplier=Element14; ComponentLink6URL: http://suddendocs.samtec.com/prints/lshm-1xx-xx.x-xx-dv-a-x-x-tr-mkt.pdf?src-supplier=Digi-Key; ComponentLink6Description: http://suddendocs.samtec.com/prints/lshm-1xx-xx.x-xx-dv-a-x-x-tr-mkt.pdf?src-supplier=Digi-Key; ComponentLink7URL: ftp://ftp.samtec.com/webfiles/PDF/LSHM.PDF?src-supplier=Avnet; ComponentLink7Description: ftp://ftp.samtec.com/webfiles/PDF/LSHM.PDF?src-supplier=Avnet; ComponentLink8URL: ftp://ftp.samtec.com/webfiles/PDF/LSHM.PDF?src-supplier=Avnet+Europe; ComponentLink8Description: ftp://ftp.samtec.com/webfiles/PDF/LSHM.PDF?src-supplier=Avnet+Europe; ComponentLink9URL: http://www.farnell.com/datasheets/2372721.pdf?src-supplier=Newark; ComponentLink9Description: http://www.farnell.com/datasheets/2372721.pdf?src-supplier=Newark; Supplier Part Number 1: SAM13196CT-ND; Manufacturer Part Number: LSHM-120-02.5-L-DV-A-N-K-TR
J2 J3 = CMP-2000-05706-1: Coaxial Connector, 18 GHz, 50 Ohm, -65 to 165 degC, 5-Pin THD, RoHS, Bulk; Manufacturer: Amphenol; Contact Termination: Solder; Dielectric Material: Polytetrafluoroethylene(PTFE); Frequency - Max: 18GHz; Body Material: Brass; Other Names: 901-144-8-RFX9011448RFXARFX1231; Center Contact Plating: Gold; Connector Type: Jack,FemaleSocket; Center Contact Material: BerylliumCopper; Impedance: 50Ohm; 3D Model: 901-144-8RFX.igs; Online Catalog: SMA,RFX; Connector Style: SMA; Category: Connectors,Interconnects; Housing Color: Gold; Mounting Type: ThroughHole; Ingress Protection: -; Packaging: Bulk; Features: -; Fastening Type: Threaded; Series: -; Standard Package: 1; Shield Termination: Solder; Mounting Technology: SurfaceMount; Family: CoaxialConnectors(RF); Package Reference: 901-144-8RFX; Datasheet URL: https://datasheet.ciiva.com/23676/c901-144-8rfx-23676337.pdf; Package Description: 5-Pin Through Hole Device, Body 7 x 7 mm, Pitch 2.54 mm; Cable Group: -; Datasheet Version: Rev. A, 01/2001; Body Finish: Gold; Operating Temperature: -65°C~165°C; Voltage Rating: -; Manufacturer URL: http://www.amphenol.com/
J4 J5 = 91931-31169LF: Conn; Rect; Industrial; MezzanineRECP; 69Cnts; SMT; I-IndustrialSeries; Package: None; Price: None; Value: *; MP: 91931-31169LF; Availability: Unavailable
R9 R15 R17-R19 R25 R26 R29 = CMP-2000-04311-1: Manufacturer: Yageo; Part Number: RC0603JR-130RL
U8 = HV2708T-C/R8X: 16-CH 200V No Hv Bias Switch (SPST), 1 Bleed Resistor 48 LQFP 7X7X1.4MM T/r Rohs Compliant: Yes; Manufacturer: Microchip; Supplier 1: Digi-Key; Manufacturer Part Number: HV2708T-C/R8X; RoHS: Yes; Category: Decoders and Multiplexers; Stock 1: 440; Pricing 1: 1=19.01000, 25=15.84720, 100=14.65500 (USD)
U15 U16 = TC2320: 8L SOIC N-Channel and P-Channel Enhancement-Mode Dual MOSFET
U17 = UCC27537: 5P SOT-23 DBV MOSFET IGBT Single-Gate-Driver
X11 X12 = CMP-00150-2: 6 Positions Header, Unshrouded Connector 0.100" (2.54mm) Through Hole Gold or Gold, GXT™; Manufacturer: Amphenol FCI; Connector Type: Male Pin; Number of Positions: 6; Row Spacing: 0.1inch; Current Rating: 3A; Gender: Male; Insulation Resistance: 5GR; Mating Post Length: 5.84mm; Max Voltage Rating (AC): 1.5kV; Packaging: Bulk; Pitch: 2.54mm; Number of Rows: 2; Contact Mating Length: 0.23inch; Termination: Solder; Manufacturer Part Number: 67996-106HLF; Supplier: Digikey; Supplier Part Number: 609-3202-ND; ComponentLink1Description: 67996-16726269.pdf; ComponentLink1URL: https://datasheet.ciiva.com/16726/67996-16726269.pdf; Case/Package: 100; Colour: Black; ComponentLink2Description: 1876884-46393071.pdf; ComponentLink2URL: https://datasheet.ciiva.com/46393/1876884-46393071.pdf; ComponentLink3Description: 67996-728918.pdf; ComponentLink3URL: https://datasheet.ciiva.com/728/67996-728918.pdf; ComponentLink4Description: 67996-10149181.pdf; ComponentLink4URL: https://datasheet.ciiva.com/10149/67996-10149181.pdf; Contact Gender: Male; Contact Material: Bronze; Contact Plating: Nickel,Gold,GXT; Depth: 4.83mm; Flammability Rating: UL94 V-0; Housing Colour: Black; Housing Material: Thermoplastic; Length: 7.62mm; Max Operating Temperature: 125°C; Min Operating Temperature: -65°C; Number of Contacts: 6; Orientation: Straight; Package Quantity: 100; Radiation Hardening: No; REACH SVHC: No SVHC; Termination Post Length: 2.41mm; Voltage Rating: 1.5kV
X13-X15 = CMP-00101-2: as X1 on sheet 00_POWER; Termination: Solder; Fastening Type: -; Features: -; Contact Finish: Gold or Gold, GXT™; Contact Finish Thickness: 15µin (0.38µm); Color: Black; Supplier: Digikey; Supplier Part Number: 609-3461-ND; ComponentLink1Description: 68000-274283-5157301.pdf; ComponentLink1URL: https://datasheet.ciiva.com/5157/68000-274283-5157301.pdf; Depth: 2.41mm; Flammability Rating: UL94 V-0; Housing Colour: Black; Housing Material: Thermoplastic; Length: 7.62mm; Manufacturer Part Number: 68000-103HLF; Max Operating Temperature: 125°C; Packaging: Bulk; Contact Type: Male Pin; Connector Type: Header, Unshrouded; Pitch: 2.54mm; Number of Rows: 1; Contact Mating Length: 0.230" (5.84mm); Mounting Type: Through Hole; Min Operating Temperature: -65°C; Number of Contacts: 3; Orientation: Straight; Package Quantity: 100; Radiation Hardening: No; REACH SVHC: No SVHC; Termination Post Length: 2.41mm; Voltage Rating: 1.5kV; Contact Gender: Male; Contact Material: Bronze; Contact Plating: Nickel,Gold,GXT; ComponentLink2Description: 68000-731071.pdf; ComponentLink2URL: https://datasheet.ciiva.com/731/68000-731071.pdf; ComponentLink3Description: 68000-10149754.pdf; ComponentLink3URL: https://datasheet.ciiva.com/10149/68000-10149754.pdf; ComponentLink4Description: 1914865-46392021.pdf; ComponentLink4URL: https://datasheet.ciiva.com/46392/1914865-46392021.pdf

## Sheet 02_CMUT_RX.SchDoc
size A3; SheetNumber: 3; SheetTotal: 3
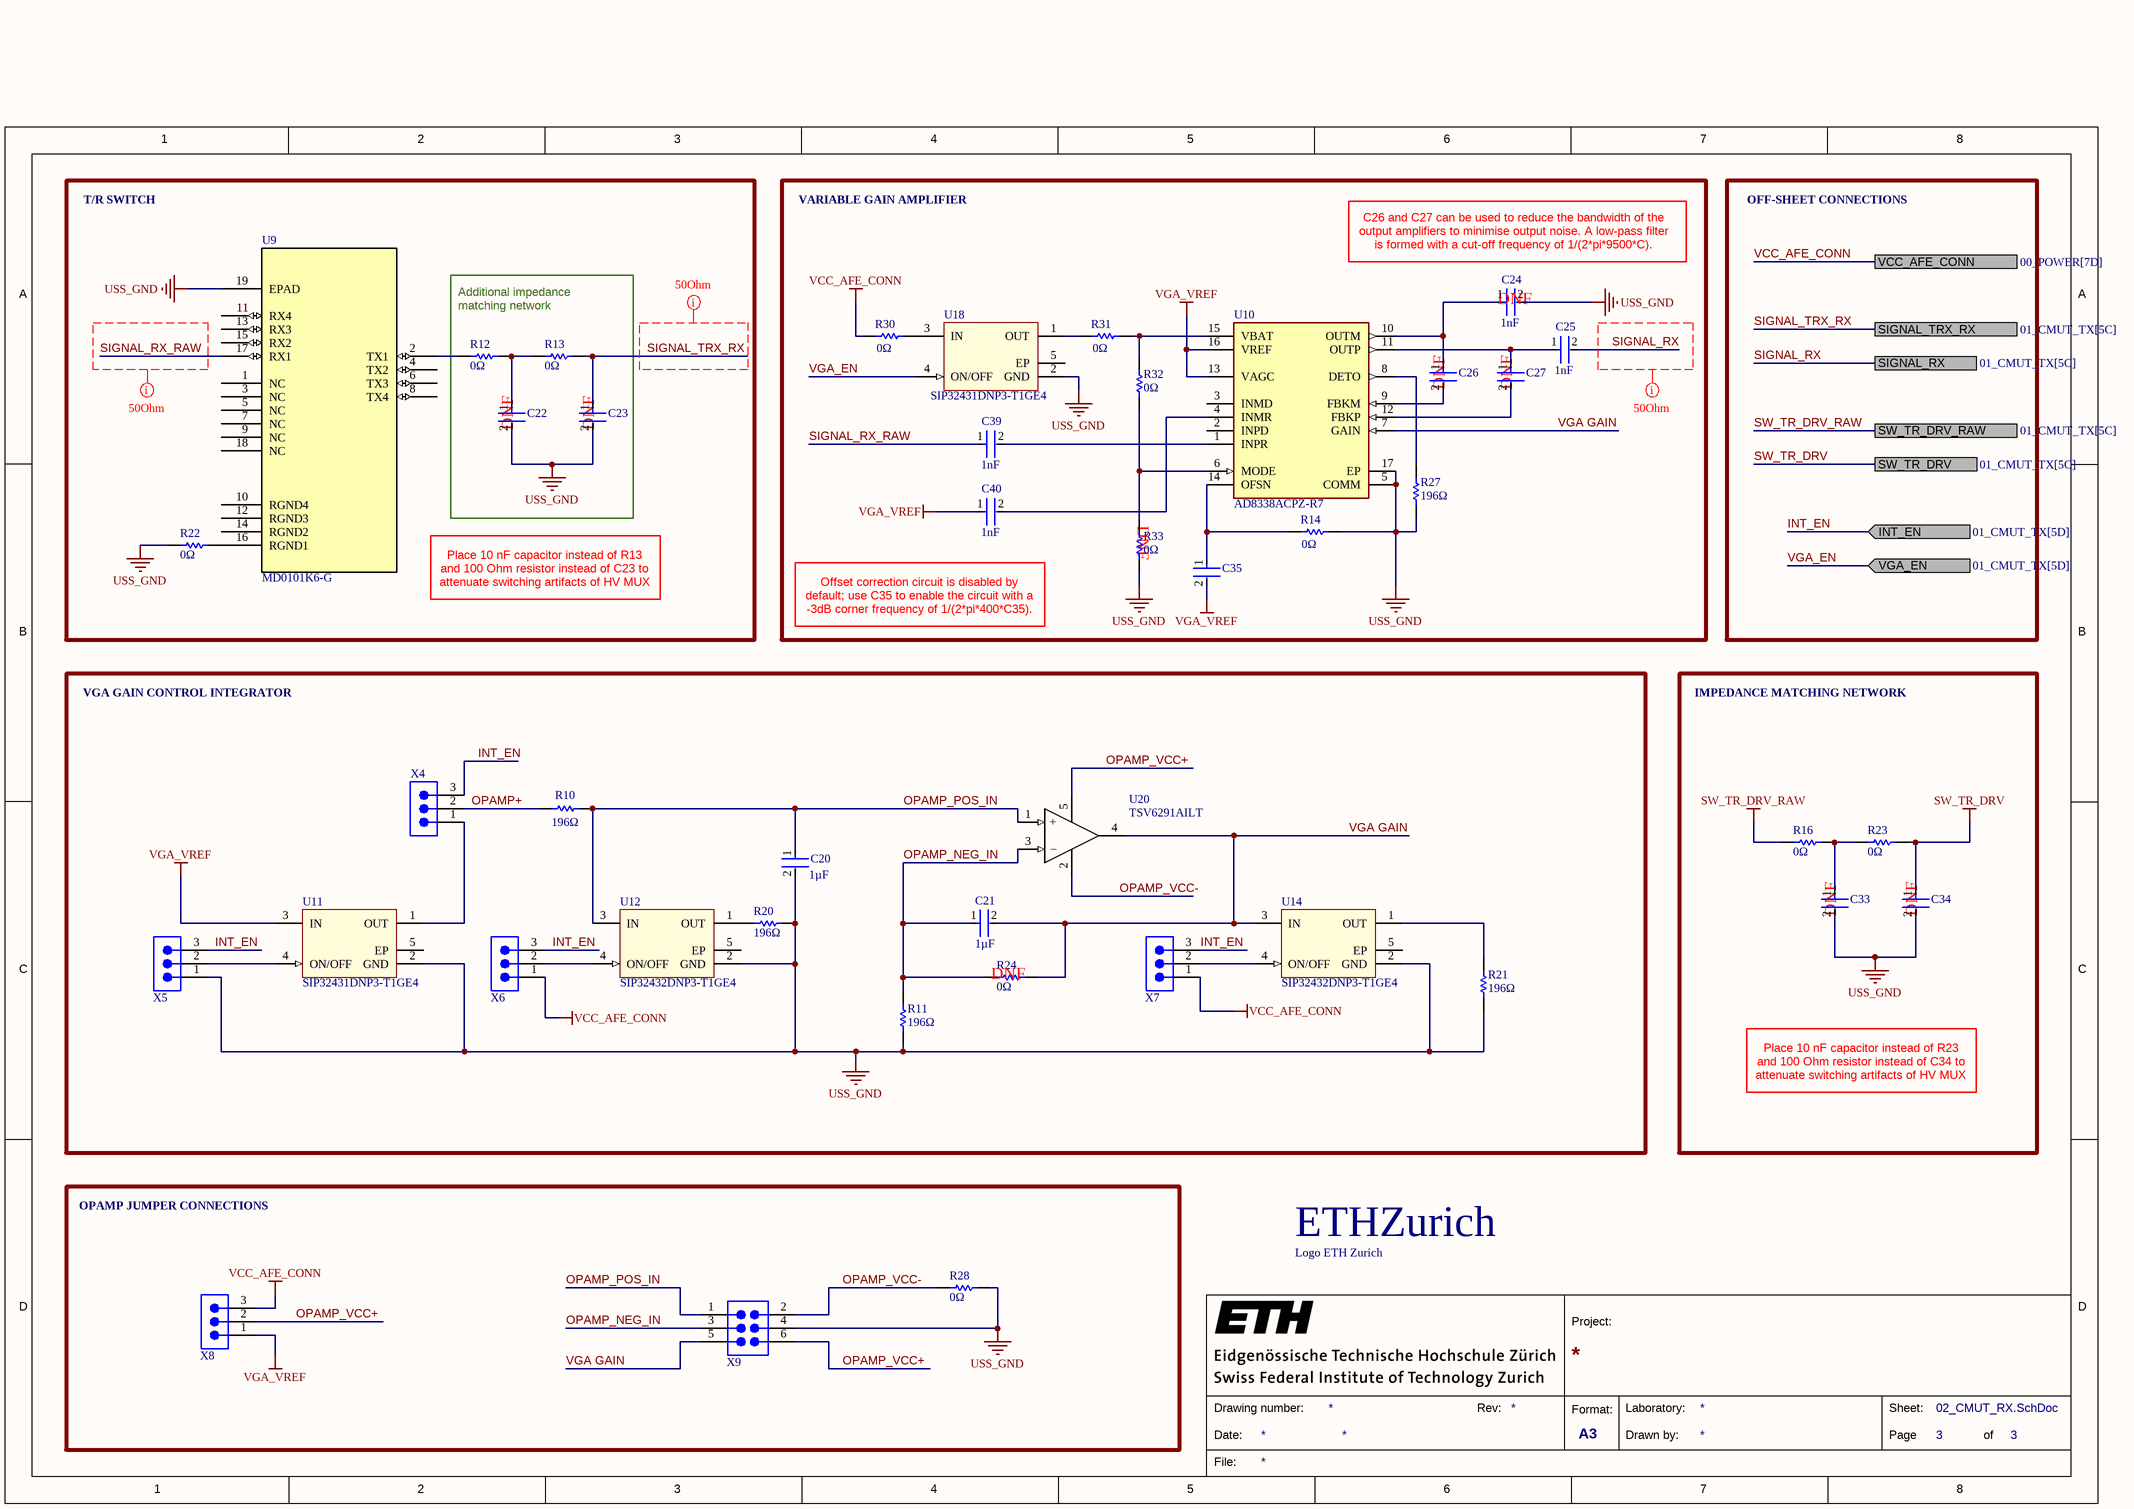
[diagram p2: 02_CMUT_RX.SchDoc]

### Parts
A1  Logo ETH Zurich  [eth-zurich_4mm]  (no BOM)
C20  Capacitance: 1µF  [FP-CGA3E-0_3-0_1-IPC_B]  (hidden comment: CGA3E3X5R1H105K)
C21  Capacitance: 1µF  [FP-CGA3E-0_3-0_1-IPC_B]  (hidden comment: CGA3E3X5R1H105K)
C22  CGA3E3X5R1H105K  [FP-CGA3E-0_3-0_1-IPC_B]  (value not drawn)
C23  CGA3E3X5R1H105K  [FP-CGA3E-0_3-0_1-IPC_B]  (value not drawn)
C24  Capacitance: 1nF  [FP-CGA3E-0_3-0_1-IPC_A]  (hidden comment: TDK CGA3E2X5R1H102K080AA)
C25  Capacitance: 1nF  [FP-CGA3E-0_3-0_1-IPC_A]  (hidden comment: TDK CGA3E2X5R1H102K080AA)
C26  CGA3E3X5R1H105K  [FP-CGA3E-0_3-0_1-IPC_B]  (value not drawn)
C27  CGA3E3X5R1H105K  [FP-CGA3E-0_3-0_1-IPC_B]  (value not drawn)
C33  CGA3E3X5R1H105K  [FP-CGA3E-0_3-0_1-IPC_B]  (value not drawn)
C34  CGA3E3X5R1H105K  [FP-CGA3E-0_3-0_1-IPC_B]  (value not drawn)
C35  CGA3E3X5R1H105K  [FP-CGA3E-0_3-0_1-IPC_B]  (value not drawn)
C39  Capacitance: 1nF  [FP-CGA3E-0_3-0_1-IPC_A]  (hidden comment: TDK CGA3E2X5R1H102K080AA)
C40  Capacitance: 1nF  [FP-CGA3E-0_3-0_1-IPC_A]  (hidden comment: TDK CGA3E2X5R1H102K080AA)
R10  Resistance: 196Ω  [RESC1608X55X25NL10T15]  (hidden comment: RC0603FR-07196RL)
R11  Resistance: 196Ω  [RESC1608X55X25NL10T15]  (hidden comment: RC0603FR-07196RL)
R12  Resistance: 0Ω  [RESC1608X55X25NL10T15]  (hidden comment: RC0603JR-130RL)
R13  Resistance: 0Ω  [RESC1608X55X25NL10T15]  (hidden comment: RC0603JR-130RL)
R14  Resistance: 0Ω  [RESC1608X55X25NL10T15]  (hidden comment: RC0603JR-130RL)
R16  Resistance: 0Ω  [RESC1608X55X25NL10T15]  (hidden comment: RC0603JR-130RL)
R20  Resistance: 196Ω  [RESC1608X55X25NL10T15]  (hidden comment: RC0603FR-07196RL)
R21  Resistance: 196Ω  [RESC1608X55X25NL10T15]  (hidden comment: RC0603FR-07196RL)
R22  Resistance: 0Ω  [RESC1608X55X25NL10T15]  (hidden comment: RC0603JR-130RL)
R23  Resistance: 0Ω  [RESC1608X55X25NL10T15]  (hidden comment: RC0603JR-130RL)
R24  Resistance: 0Ω  [RESC1608X55X25NL10T15]  (hidden comment: RC0603JR-130RL)
R27  Resistance: 196Ω  [RESC1608X55X25NL10T15]  (hidden comment: RC0603FR-07196RL)
R28  Resistance: 0Ω  [RESC1608X55X25NL10T15]  (hidden comment: RC0603JR-130RL)
R30  Resistance: 0Ω  [RESC1608X55X25NL10T15]  (hidden comment: RC0603JR-130RL)
R31  Resistance: 0Ω  [RESC1608X55X25NL10T15]  (hidden comment: RC0603JR-130RL)
R32  Resistance: 0Ω  [RESC1608X55X25NL10T15]  (hidden comment: RC0603JR-130RL)
R33  Resistance: 0Ω  [RESC1608X55X25NL10T15]  (hidden comment: RC0603JR-130RL)
U9  MD0101K6-G  [DFN18_5X5_MCH]
U10  AD8338ACPZ-R7  [FP-CP-16-22-IPC_C]
U11  SIP32431DNP3-T1GE4  [TDFN-4_V]
U12  SIP32432DNP3-T1GE4  [TDFN-4_V]
U14  SIP32432DNP3-T1GE4  [TDFN-4_V]
U18  SIP32431DNP3-T1GE4  [TDFN-4_V]
U20  TSV6291AILT  [SOT95P280X145-5N]
X4  68000-103HLF  [68000-103HLF]  (value not drawn)
X5  68000-103HLF  [68000-103HLF]  (value not drawn)
X6  68000-103HLF  [68000-103HLF]  (value not drawn)
X7  68000-103HLF  [68000-103HLF]  (value not drawn)
X8  68000-103HLF  [68000-103HLF]  (value not drawn)
X9  67996-106HLF  [67996-106HLF]  (value not drawn)

### Blocks framed on the sheet
DNF: C20 C21 R10 R11 R20 R21 R24 U11 U12 U14 U20 X4-X7
OPAMP JUMPER CONNECTIONS: R28 X8 X9

### Ports
INT_EN (in, see 01_CMUT_TX[5D]), SIGNAL_RX (see 01_CMUT_TX[5C]), SIGNAL_TRX_RX (see 01_CMUT_TX[5C]), SW_TR_DRV (see 01_CMUT_TX[5C]), SW_TR_DRV_RAW (see 01_CMUT_TX[5C]), VCC_AFE_CONN (see 00_POWER[7D]), VGA_EN (in, see 01_CMUT_TX[5D])

### Nets
SW_TR_DRV: C34.1 R23.1 ; port SW_TR_DRV
SW_TR_DRV_RAW: R16.2 ; port SW_TR_DRV_RAW
USS_GND: C20.2 C22.2 C23.2 C24.2 C33.2 C34.2 R11.1 R14.1 R20.1 R21.2 R22.2 R27.2 R28.2 R33.2 U9.19(EPAD) U10.5(COMM) U10.17(EP) U11.2(GND) U12.2(GND) U14.2(GND) U18.2(GND) X5.1 X9.4
VCC_AFE_CONN: R30.2 X6.1 X7.1 X8.3 ; port VCC_AFE_CONN
VGA_VREF: C35.2 C40.1 U10.13(VAGC) U10.16(VREF) U11.3(IN) X8.1
INT_EN: X4.3 X5.3 X6.3 X7.3 ; port INT_EN
OPAMP+: R10.1 X4.2
OPAMP_NEG_IN: C21.1 R11.2 R24.2 U20.3 X9.3
OPAMP_POS_IN: C20.1 R10.2 U12.3(IN) U20.1 X9.1
OPAMP_VCC+: U20.5 X8.2 X9.6
OPAMP_VCC-: R28.1 U20.2 X9.2
SIGNAL_RX: C25.2 ; port SIGNAL_RX
SIGNAL_RX_RAW: C39.1 U9.17(RX1)
SIGNAL_TRX_RX: C23.1 R13.1 ; port SIGNAL_TRX_RX
VGA GAIN: C21.2 R24.1 U10.7(GAIN) U14.3(IN) U20.4 X9.5
VGA_EN: U18.4(ON/OFF) ; port VGA_EN
NetC22_1: C22.1 R12.1 R13.2
NetC24_1: C24.1 C26.1 U10.10(OUTM)
NetC25_1: C25.1 C27.1 U10.11(OUTP)
NetC26_2: C26.2 U10.9(FBKM)
NetC27_2: C27.2 U10.12(FBKP)
NetC33_1: C33.1 R16.1 R23.2
NetC35_1: C35.1 R14.2 U10.14(OFSN)
NetC39_2: C39.2 U10.1(INPR)
NetC40_2: C40.2 U10.4(INMR)
NetR12_2: R12.2 U9.2(TX1)
NetR20_2: R20.2 U12.1(OUT)
NetR21_1: R21.1 U14.1(OUT)
NetR22_1: R22.1 U9.16(RGND1)
NetR27_1: R27.1 U10.8(DETO)
NetR30_1: R30.1 U18.3(IN)
NetR31_1: R31.1 R32.1 U10.15(VBAT)
NetR31_2: R31.2 U18.1(OUT)
NetR32_2: R32.2 R33.1 U10.6(MODE)
NetU11_1: U11.1(OUT) X4.1
NetU11_4: U11.4(ON/OFF) X5.2
NetU12_4: U12.4(ON/OFF) X6.2
NetU14_4: U14.4(ON/OFF) X7.2

Not connected (* = marked no-connect by the designer): U9 1(NC) 3(NC) 4(TX2) 5(NC) 6(TX3) 7(NC) 8(TX4) 9(NC) 10(RGND4) 11(RX4) 12(RGND3) 13(RX3) 14(RGND2) 15(RX2) 18(NC); U10 2(INPD) 3(INMD); U11 5(EP); U12 5(EP); U14 5(EP); U18 5(EP)

### Layout directives
net class *: SIGNAL_RX, SIGNAL_RX_RAW, SIGNAL_TRX_RX

### Notes on the sheet
- T/R SWITCH
- VARIABLE GAIN AMPLIFIER
- OFF-SHEET CONNECTIONS
- Additional impedance matching network
- (near C24) C26 and C27 can be used to reduce the bandwidth of the output amplifiers to minimise output noise. A low-pass filter is formed with a cut-off frequency of 1/(2*pi*9500*C).
- (near C24) DNF
- (near C22) DNF
- (near C23) DNF
- (near C26) DNF
- (near C27) DNF
- (near U9) Place 10 nF capacitor instead of R13 and 100 Ohm resistor instead of C23 to attenuate switching artifacts of HV MUX
- (near R33) DNF
- Offset correction circuit is disabled by default; use C35 to enable the circuit with a -3dB corner frequency of 1/(2*pi*400*C35).
- VGA GAIN CONTROL INTEGRATOR
- IMPEDANCE MATCHING NETWORK
- (near C33) DNF
- (near C34) DNF
- Place 10 nF capacitor instead of R23 and 100 Ohm resistor instead of C34 to attenuate switching artifacts of HV MUX
- 1
- 2
- 3
- 4
- 5
- 6
- 7
- 8
- A
- B
- C
- D
- Project:
- Date:
- Drawing number:
- Rev:
- Format:
- A3
- Drawn by:
- Laboratory:
- Page
- Sheet:
- of
- File:
- (in symbol CMP-00038-1) ETHZurich
- (in symbol TSV6291AILT) +; _

### Library data of the parts
A1 = CMP-00038-1
C20-C23 C26 C27 C33-C35 = CMP-08246-000317-1: as C1 on sheet 00_POWER; Termination: SMD/SMT; Tolerance: 10%; Case Code (Metric): 1608; Max Operating Temperature: 85°C; Case/Package: 0603; Voltage Rating: 50V; Dielectric: X5R; Case Code (Imperial): 0603; Packaging: Tape and Reel; Min Operating Temperature: -55°C; Voltage Rating (DC): 50V
  C22 C23 C26 C27 C33-C35: Capacitance: 1uF
C24 C25 C39 C40 = CMP-08246-002238-1: Cap Ceramic 1nF 50V X5R 10% Pad SMD 0603 +85°C Automotive T/R; Min Operating Temperature: -55°C; Packaging: Tape and Reel; Package Quantity: 4000; Case Code (Metric): 1608; Ratings: AEC-Q200; Height: 0.8mm; Case/Package: 0603; Width: 0.031inch; Voltage Rating (DC): 50V; Termination: SMD/SMT; Mount: Surface Mount; Case Code (Imperial): 0603; Max Operating Temperature: 85°C; Weight: 7.1E-05oz; Length: 0.063inch; Voltage Rating: 50V; Dielectric: X5R; Thickness: 0.035inch; Tolerance: 10%
R10 R11 R20 R21 R27 = CMP-2000-03929-1: Manufacturer: Yageo; Part Number: RC0603FR-07196RL
R12-R14 R16 R22-R24 R28 R30-R33 = CMP-2000-04311-1: Manufacturer: Yageo; Part Number: RC0603JR-130RL
U9 = MD0101K6-G: No Description Available; Mfr_Name: Microchip; Copyright: Copyright (C) 2022 Ultra Librarian. All rights reserved.; Manufacturer_Part_Number: MD0101K6-G; RefDes: RefDes; Type: DEV
U10 = CMP-09116-000032-1: IC OPAMP VGA 1 CIRCUIT 16LFCSP; Manufacturer: Analog Devices; Nominal Supply Current: 3-6mA; Max Supply Voltage: 5V; Number Of Channels: 1; Output Current Per Channel: 5mA; Max Junction Temp: +150°C; Min Supply Voltage: 3V; Bandwidth: 18MHz; Voltage Gain: 80dB; Mouser Description: Special Purpose Amplifiers Ultra Low Pwr 18MHz SGL CH VGA; Device Class L2: Linear ICs; Ipc Land Pattern Name: QFN50P300X300X75-16; Temperature Range Low: -40°C; Device Class L1: Integrated Circuits (ICs); RoHS: TRUE; Digikey Description: IC OPAMP VGA 1 CIRCUIT 16LFCSP; Category: IC; ComponentLink2URL: https://www.analog.com/media/en/technical-documentation/data-sheets/AD8338.pdf; Automotive: No; Height: 0.8mm; Manufacturer Part Number: AD8338ACPZ-R7; Octopart: https://octopart.com/ad8338acpz-r7-analog+devices-21054770; Temperature: -40°C to +85°C; ComponentLink2Description: Datasheet; Lead Free: Yes; Temperature Range High: +85°C; Package: CP-16-22; Device Class L3: Amplifiers - Op Amps
U11 U12 U14 U18 = CMP-00918-1: Power Switch ICs - Power Distribution 1A Slew Rate Ctrl Load Switch; Number of Outputs: 1; Max Power Dissipation: 324mW; Max Supply Voltage: 5.5V; Min Supply Voltage: 1.1V; Interface: On/Off; Max Output Current: 1.4A; On-State Resistance: 520mR; Turn-Off Delay Time: 10us; Turn-On Delay Time: 40us; Fault Protection: Reverse Current; Output Configuration: High Side; Mount: Surface Mount; Number of Pins: 4; Weight: 0.001764oz; Min Operating Temperature: -40°C; Max Operating Temperature: 85°C; Output Current: 1A; Packaging: Tape and Reel; Package Quantity: 3000; Power Dissipation: 324mW; Radiation Hardening: No; Lead Free: Lead Free
U20 = TSV6291AILT: TVS6291A Series 5.5 V 1.3 MHz Single CMOS Operational Amplifier - SOT-23-5
X4-X8 = CMP-00101-2: as X1 on sheet 00_POWER; Termination: Solder; Fastening Type: -; Features: -; Contact Finish: Gold or Gold, GXT™; Contact Finish Thickness: 15µin (0.38µm); Color: Black; Supplier: Digikey; Supplier Part Number: 609-3461-ND; ComponentLink1Description: 68000-274283-5157301.pdf; ComponentLink1URL: https://datasheet.ciiva.com/5157/68000-274283-5157301.pdf; Depth: 2.41mm; Flammability Rating: UL94 V-0; Housing Colour: Black; Housing Material: Thermoplastic; Length: 7.62mm; Manufacturer Part Number: 68000-103HLF; Max Operating Temperature: 125°C; Packaging: Bulk; Contact Type: Male Pin; Connector Type: Header, Unshrouded; Pitch: 2.54mm; Number of Rows: 1; Contact Mating Length: 0.230" (5.84mm); Mounting Type: Through Hole; Min Operating Temperature: -65°C; Number of Contacts: 3; Orientation: Straight; Package Quantity: 100; Radiation Hardening: No; REACH SVHC: No SVHC; Termination Post Length: 2.41mm; Voltage Rating: 1.5kV; Contact Gender: Male; Contact Material: Bronze; Contact Plating: Nickel,Gold,GXT; ComponentLink2Description: 68000-731071.pdf; ComponentLink2URL: https://datasheet.ciiva.com/731/68000-731071.pdf; ComponentLink3Description: 68000-10149754.pdf; ComponentLink3URL: https://datasheet.ciiva.com/10149/68000-10149754.pdf; ComponentLink4Description: 1914865-46392021.pdf; ComponentLink4URL: https://datasheet.ciiva.com/46392/1914865-46392021.pdf
X9 = CMP-00150-2: as X11 on sheet 01_CMUT_TX; Packaging: Bulk; Pitch: 2.54mm; Number of Rows: 2; Contact Mating Length: 0.23inch; Termination: Solder; Manufacturer Part Number: 67996-106HLF; Supplier: Digikey; Supplier Part Number: 609-3202-ND; ComponentLink1Description: 67996-16726269.pdf; ComponentLink1URL: https://datasheet.ciiva.com/16726/67996-16726269.pdf; Case/Package: 100; Colour: Black; ComponentLink2Description: 1876884-46393071.pdf; ComponentLink2URL: https://datasheet.ciiva.com/46393/1876884-46393071.pdf; ComponentLink3Description: 67996-728918.pdf; ComponentLink3URL: https://datasheet.ciiva.com/728/67996-728918.pdf; ComponentLink4Description: 67996-10149181.pdf; ComponentLink4URL: https://datasheet.ciiva.com/10149/67996-10149181.pdf; Contact Gender: Male; Contact Material: Bronze; Contact Plating: Nickel,Gold,GXT; Depth: 4.83mm; Flammability Rating: UL94 V-0; Housing Colour: Black; Housing Material: Thermoplastic; Length: 7.62mm; Max Operating Temperature: 125°C; Min Operating Temperature: -65°C; Number of Contacts: 6; Orientation: Straight; Package Quantity: 100; Radiation Hardening: No; REACH SVHC: No SVHC; Termination Post Length: 2.41mm; Voltage Rating: 1.5kV

## Nets that join several sheets
SW_TR_DRV: 01_CMUT_TX (8 pins), 02_CMUT_RX (C34.1 R23.1)
SW_TR_DRV_RAW: 01_CMUT_TX (X12.3), 02_CMUT_RX (R16.2)
USS_GND: 00_POWER (27 pins), 01_CMUT_TX (30 pins), 02_CMUT_RX (23 pins)
VCC_AFE_CONN: 00_POWER (C14.1 L5.1 U3.1 X1.2), 01_CMUT_TX (J1.29 J1.30 J1.31 J1.32), 02_CMUT_RX (R30.2 X6.1 X7.1 X8.3)
VCC_HV_NEG_OUT: 00_POWER (C32.1 FB2.2), 01_CMUT_TX (J4.1 J4.35 J5.1 J5.35)
VCC_HV_POS_OUT: 00_POWER (C13.1 FB1.2), 01_CMUT_TX (X13.3 X14.3 X15.1)
VCC_SW_REG_OUT: 00_POWER (C15.1 C36.1 U3.2 U3.4), 01_CMUT_TX (C16.1 C17.1 U8.15)
HV_EN1: 00_POWER (U1.9 U2.2), 01_CMUT_TX (J1.15)
HV_EN2: 00_POWER (U1.8 U2.4), 01_CMUT_TX (J1.17)
INT_EN: 01_CMUT_TX (INT_EN.1 J1.21), 02_CMUT_RX (X4.3 X5.3 X6.3 X7.3)
SIGNAL_RX: 01_CMUT_TX (J1.40), 02_CMUT_RX (C25.2)
SIGNAL_TRX_RX: 01_CMUT_TX (8 pins), 02_CMUT_RX (C23.1 R13.1)
SW_EN: 00_POWER (U3.6), 01_CMUT_TX (J1.13)
VGA_EN: 01_CMUT_TX (J1.07 VGA_EN.1), 02_CMUT_RX (U18.4)